# EAGLE schematic pcb6 (EAGLE 6.4)
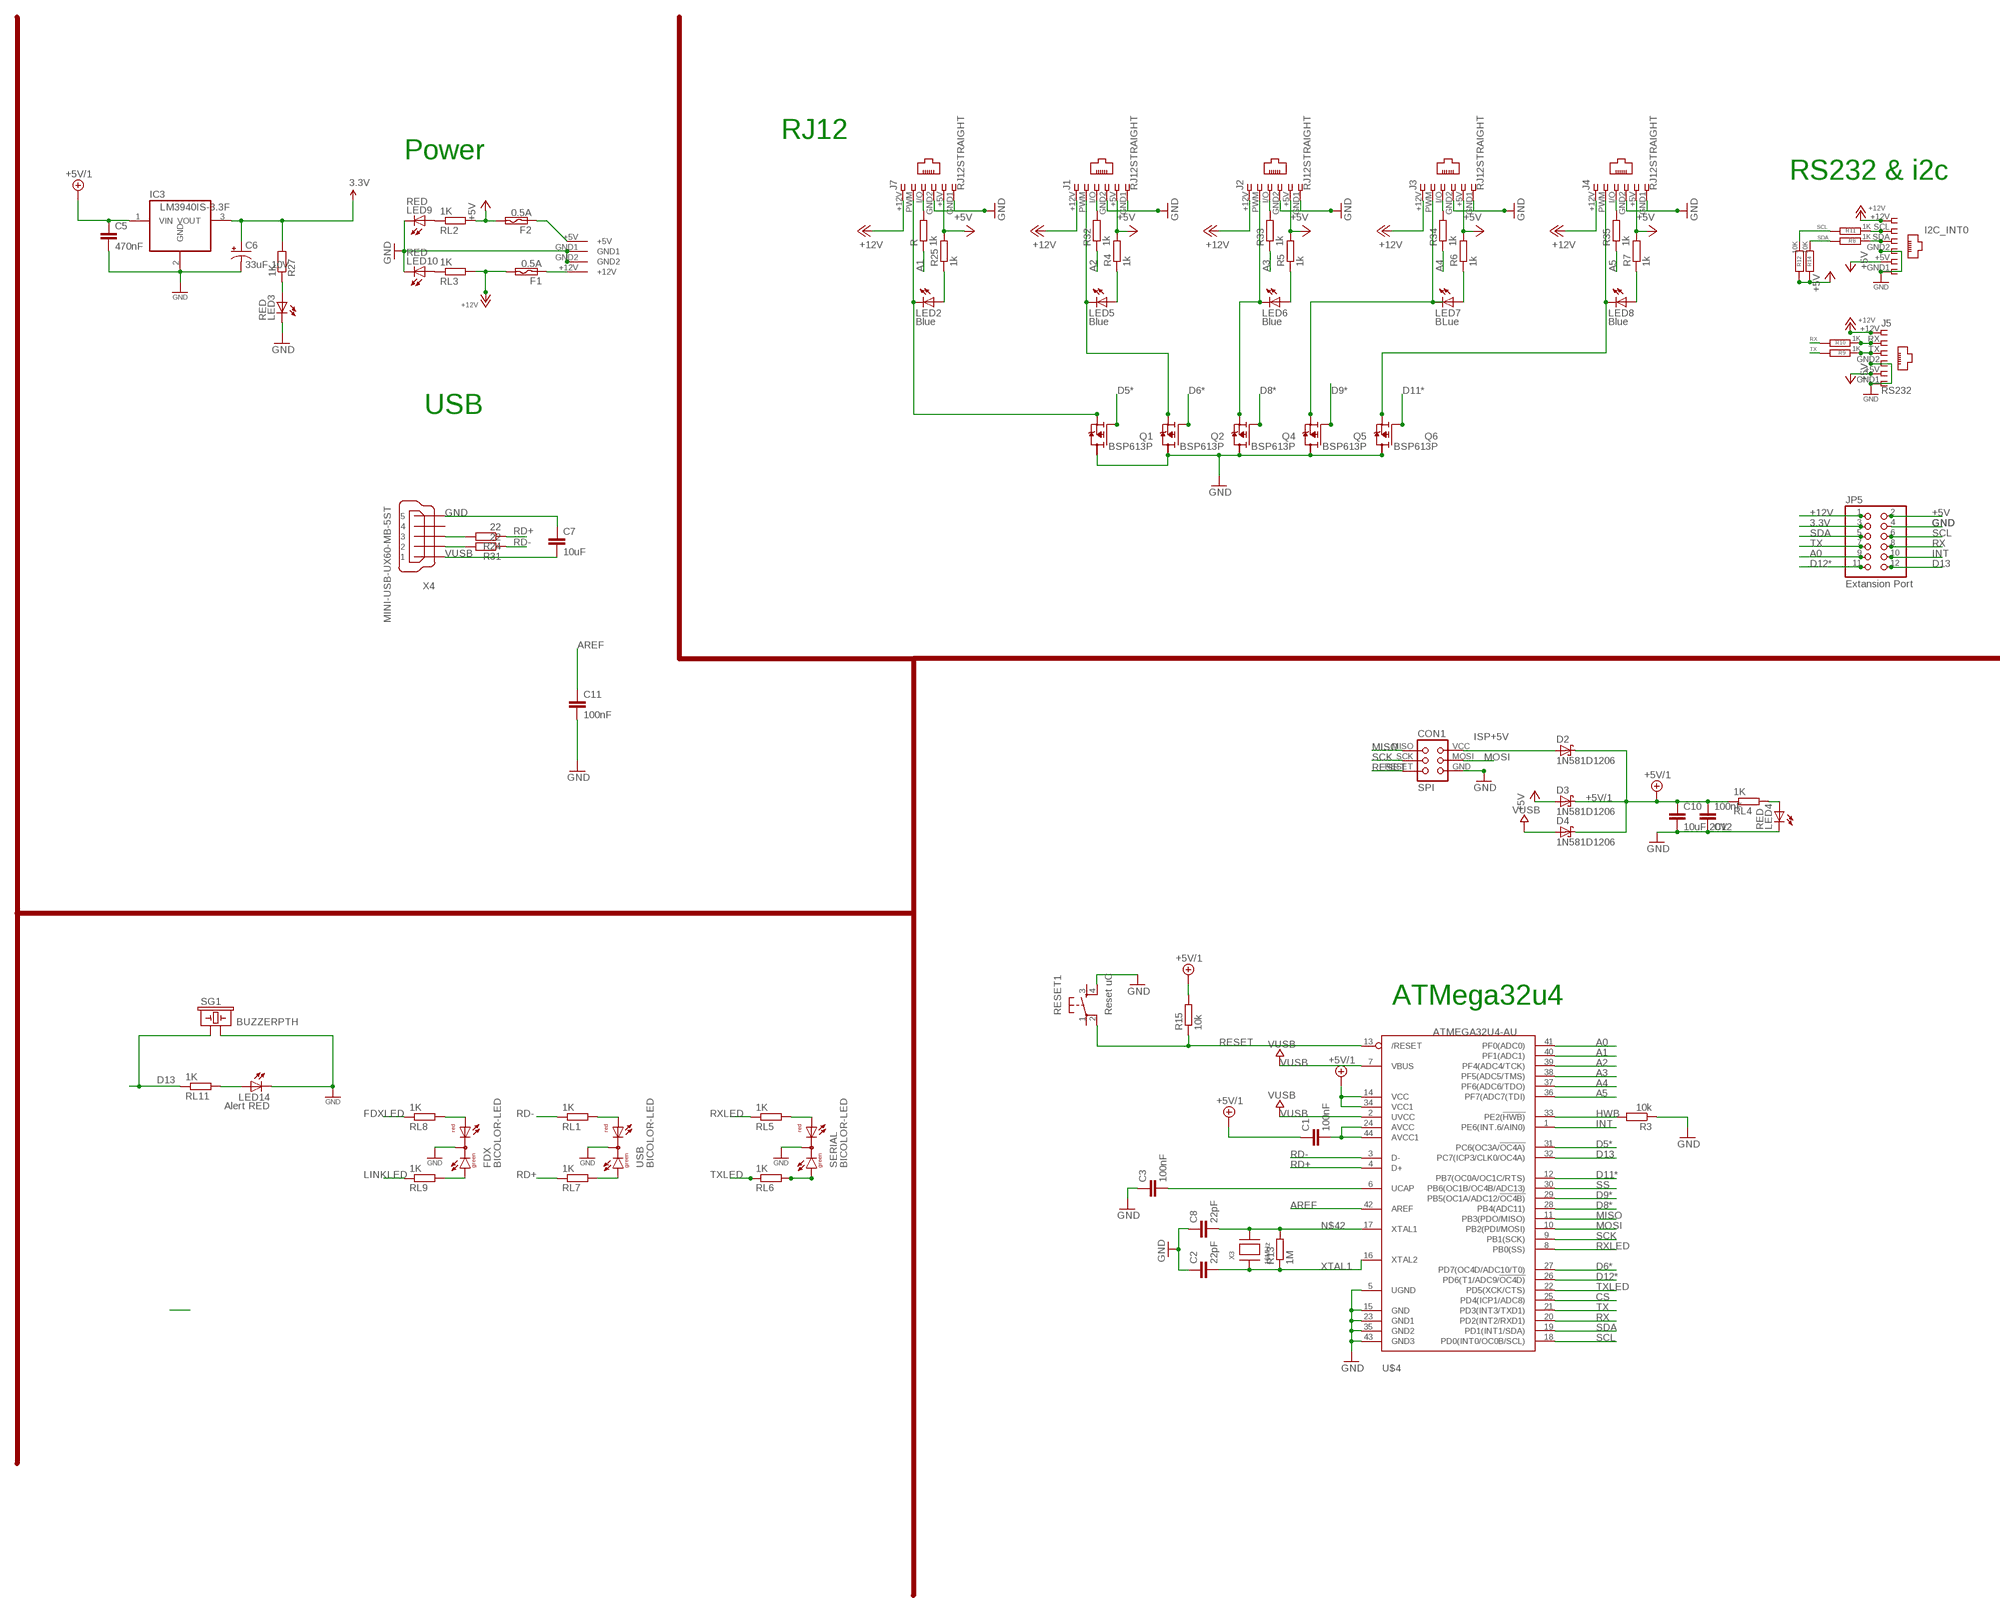
[diagram p0: schematic, sheet 1, part 1 of 2]
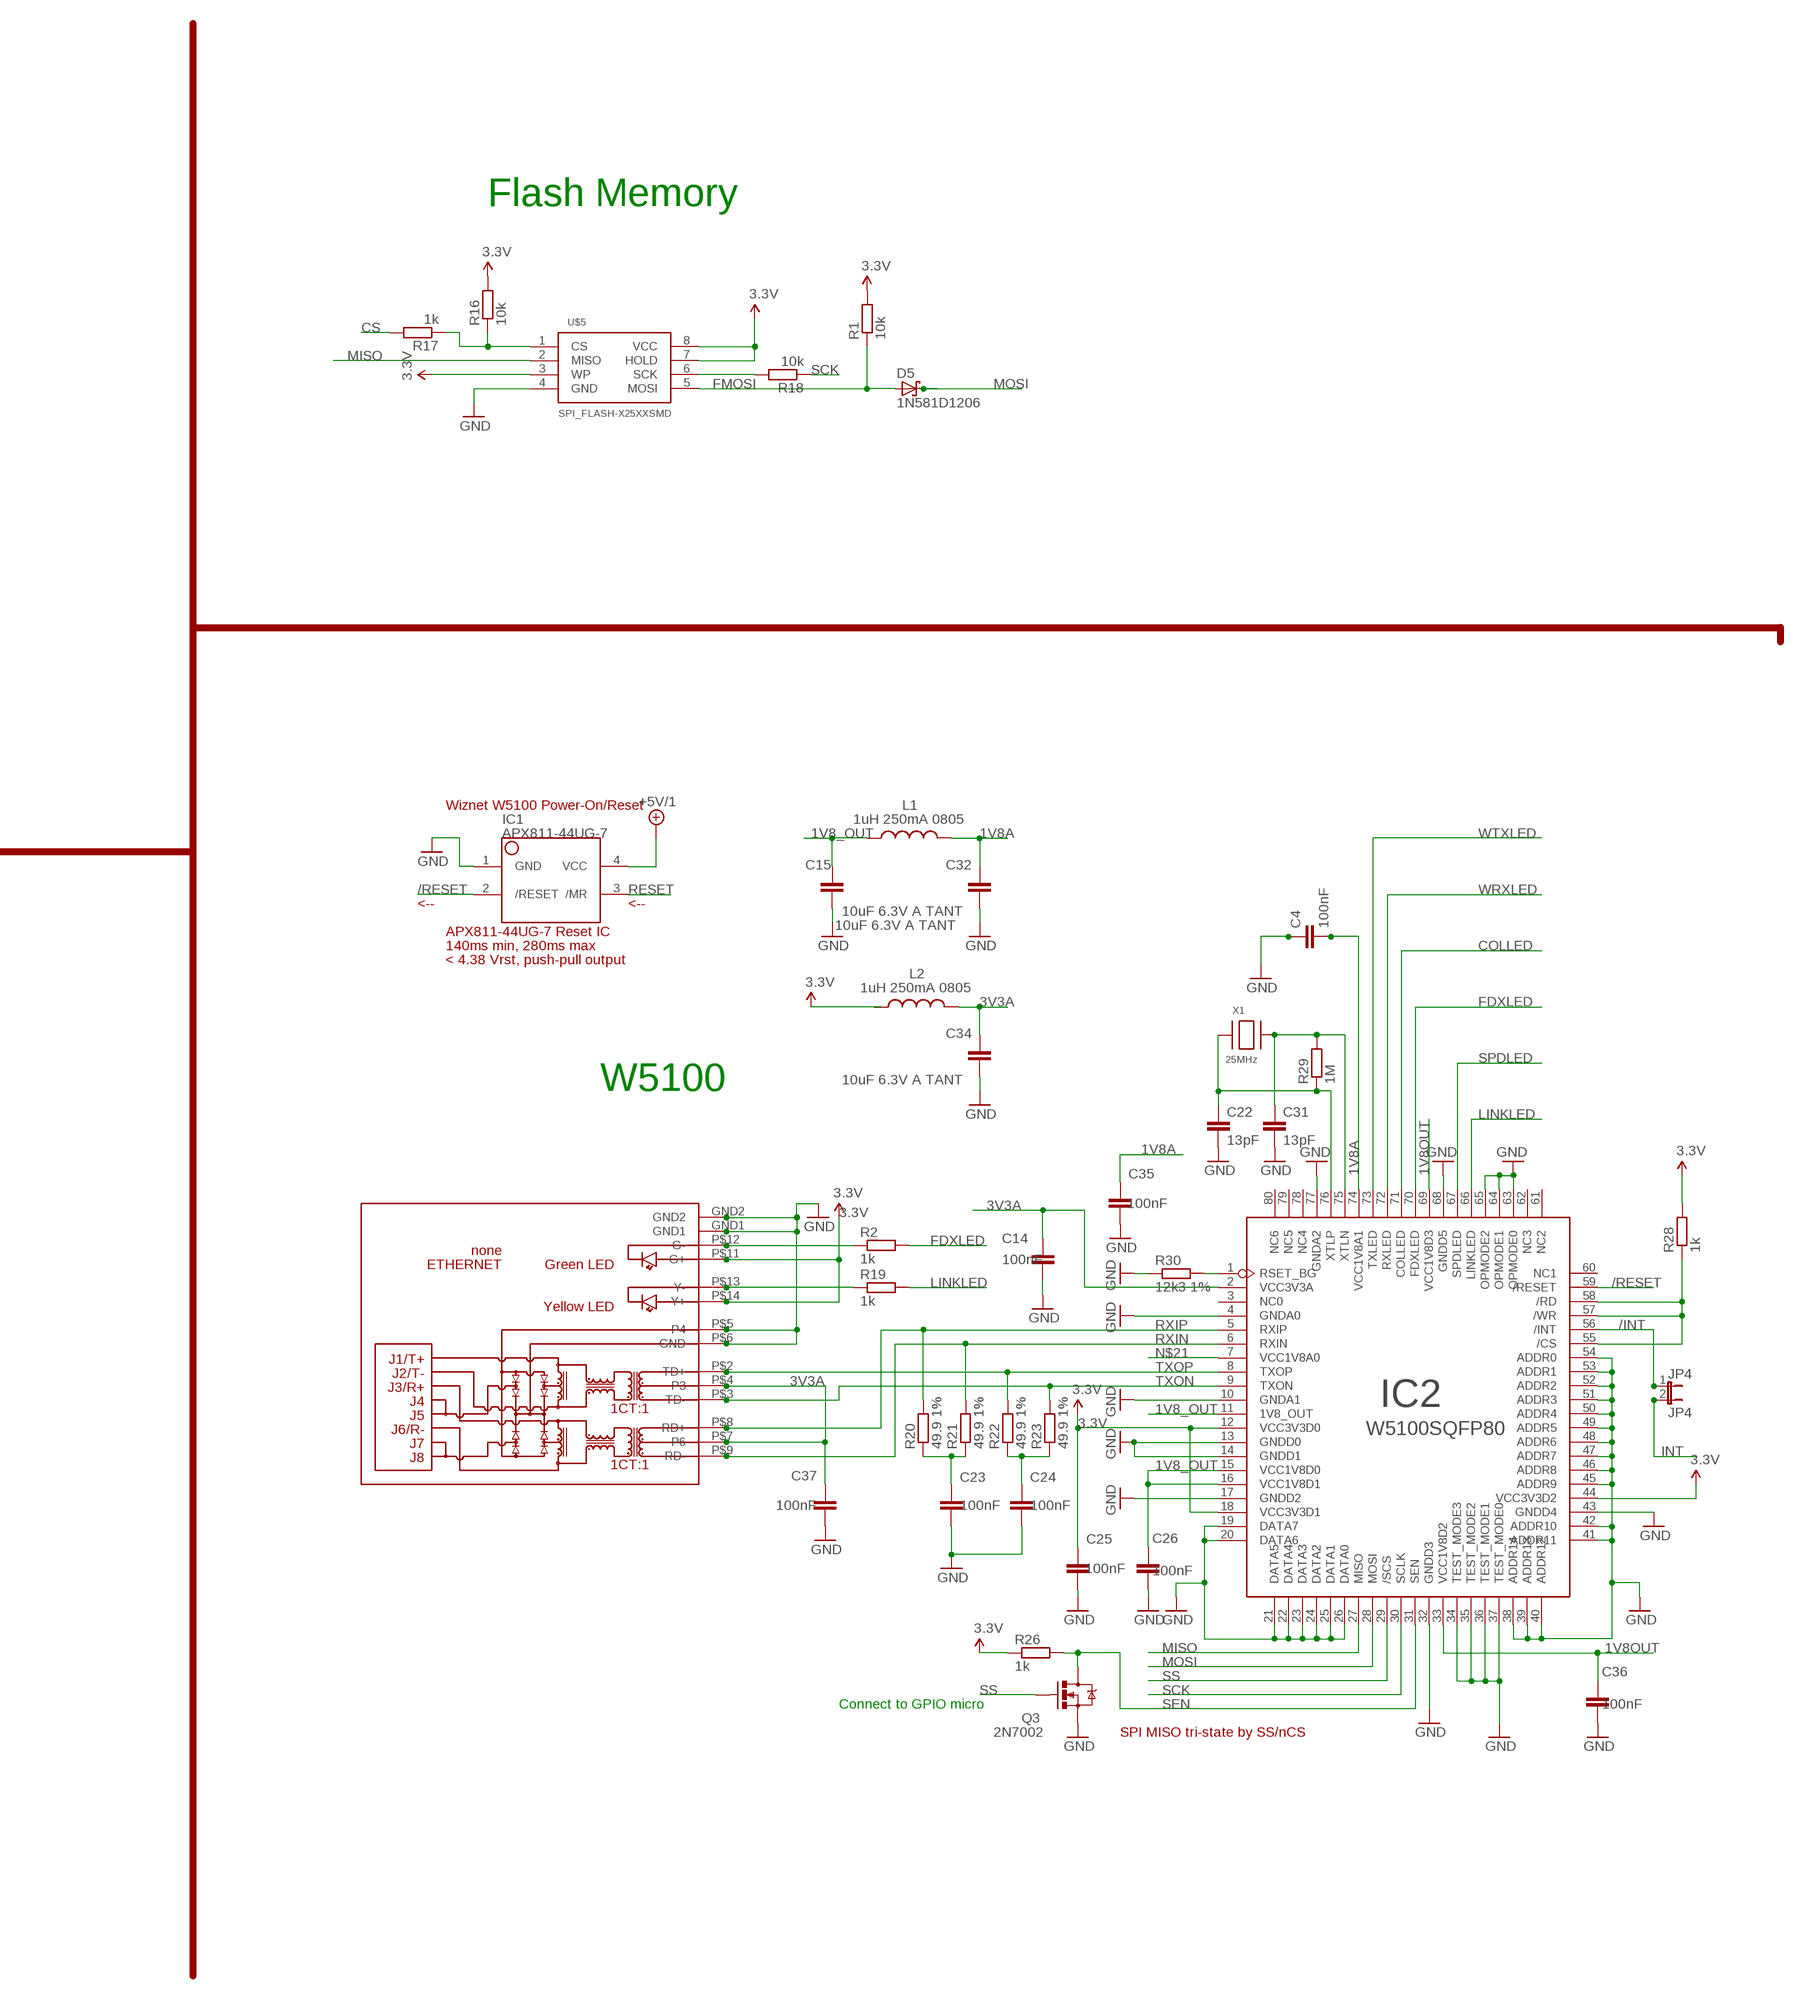
[diagram p1: schematic, sheet 1, part 2 of 2]

## Parts
C1  100nF  C-EUC1206  [C1206]
C2  22pF  C-EUC1206  [C1206]
C3  100nF  C-EUC1206  [C1206]
C4  100nF  C-EUC1206  [C1206]
C5  470nF  C-EUC1206  [C1206]
C6  33uF 10V  CAP_POL7343  [EIA7343]
C7  10uF  C-EUC1206  [C1206]
C8  22pF  C-EUC1206  [C1206]
C10  10uF 20V  C-EUC1206  [C1206]
C11  100nF  C-EUC1206  [C1206]
C12  100nF  C-EUC1206  [C1206]
C14  100nF  C-EUC1206  [C1206]
C15  10uF 6.3V A TANT  C-EUC1206  [C1206]
C22  13pF  C-EUC1206  [C1206]
C23  100nF  C-EUC1206  [C1206]
C24  100nF  C-EUC1206  [C1206]
C25  100nF  C-EUC1206  [C1206]
C26  100nF  C-EUC1206  [C1206]
C31  13pF  C-EUC1206  [C1206]
C32  10uF 6.3V A TANT  C-EUC1206  [C1206]
C34  10uF 6.3V A TANT  C-EUC1206  [C1206]
C35  100nF  C-EUC1206  [C1206]
C36  100nF  C-EUC1206  [C1206]
C37  100nF  C-EUC1206  [C1206]
CON1  SPI  TINYISP  [TINYISP]
D2  1N581D1206  [LED-1206]
D3  1N581D1206  [LED-1206]
D4  1N581D1206  [LED-1206]
D5  1N581D1206  [LED-1206]
ETHERNET  none  HY911103AHY911103A  [HY931147C]
F1  0.5A  POLYSWITCHSMD1812  [C1812]
F2  0.5A  POLYSWITCHSMD1812  [C1812]
FDX  BICOLOR-LED  [BICOLOR-3MM]
I2C_INT0  I2C  RJ12STRAIGHT-I2C  [RJ12-STRAIGHT-I2C]
IC1  APX811-44UG-7  APX81X-RESET-IC  [SOT143-R]
IC2  W5100SQFP80  [SQFP80]
IC3  LM3940IS-3.3F  [DD-3]
J1  RJ12STRAIGHT  [RJ12-STRAIGHT]
J2  RJ12STRAIGHT  [RJ12-STRAIGHT]
J3  RJ12STRAIGHT  [RJ12-STRAIGHT]
J4  RJ12STRAIGHT  [RJ12-STRAIGHT]
J5  RS232  RJ12STRAIGHT-RS232-SERVER  [RJ12-STRAIGHT-RS232]
J7  RJ12STRAIGHT  [RJ12-STRAIGHT]
JP4  JP4  JUMPER-2PTH  [1X02]
JP5  Extansion Port  PINHD-2X6  [2X06]
L1  1uH 250mA 0805  L-USL2012C  [L2012C]
L2  1uH 250mA 0805  L-USL2012C  [L2012C]
LED2  Blue  LED3MM  [LED3MM]
LED3  RED  LED3MM  [LED3MM]
LED4  RED  LED3MM  [LED3MM]
LED5  Blue  LED3MM  [LED3MM]
LED6  Blue  LED3MM  [LED3MM]
LED7  BLue  LED3MM  [LED3MM]
LED8  Blue  LED3MM  [LED3MM]
LED9  RED  LED3MM  [LED3MM]
LED10  RED  LED3MM  [LED3MM]
LED14  Alert RED  LED3MM  [LED3MM]
Q1  BSP613P  [PG-SOT-223]
Q2  BSP613P  [PG-SOT-223]
Q3  2N7002  MOSFET-NCHANNELSMD  [SOT23-3]
Q4  BSP613P  [PG-SOT-223]
Q5  BSP613P  [PG-SOT-223]
Q6  BSP613P  [PG-SOT-223]
R  1k  R-EU_R0805  [R0805]
R1  10k  R-EU_R1206  [R1206]
R2  1k  R-EU_R0805  [R0805]
R3  10k  R-EU_R1206  [R1206]
R4  1k  R-EU_R0805  [R0805]
R5  1k  R-EU_R0805  [R0805]
R6  1k  R-EU_R0805  [R0805]
R7  1k  R-EU_R0805  [R0805]
R8  1K  R-EU_R0805  [R0805]
R9  1K  R-EU_R0805  [R0805]
R10  1K  R-EU_R0805  [R0805]
R11  1K  R-EU_R0805  [R0805]
R12  10K  R-EU_R1206  [R1206]
R13  1M  R-EU_R1206  [R1206]
R14  10K  R-EU_R1206  [R1206]
R15  10k  R-EU_R1206  [R1206]
R16  10k  R-EU_R1206  [R1206]
R17  1k  R-EU_R0805  [R0805]
R18  10k  R-EU_R1206  [R1206]
R19  1k  R-EU_R0805  [R0805]
R20  49.9 1%  R-EU_R0805W  [R0805W]
R21  49.9 1%  R-EU_R0805W  [R0805W]
R22  49.9 1%  R-EU_R0805W  [R0805W]
R23  49.9 1%  R-EU_R0805W  [R0805W]
R24  22  R-EU_M1206  [M1206]
R25  1k  R-EU_R0805  [R0805]
R26  1k  R-EU_R0805  [R0805]
R27  1K  R-EU_R0805  [R0805]
R28  1k  R-EU_R0805  [R0805]
R29  1M  R-EU_R1206  [R1206]
R30  12k3 1%  R-EU_R0805W  [R0805W]
R31  22  R-EU_M1206  [M1206]
R32  1k  R-EU_R0805  [R0805]
R33  1k  R-EU_R0805  [R0805]
R34  1k  R-EU_R0805  [R0805]
R35  1k  R-EU_R0805  [R0805]
RESET1  Reset uC  TAC_SWITCHSMD  [TACTILE_SWITCH_SMD]
RL1  1K  R-EU_R0805  [R0805]
RL2  1K  R-EU_R0805  [R0805]
RL3  1K  R-EU_R0805  [R0805]
RL4  1K  R-EU_R0805  [R0805@1]
RL5  1K  R-EU_R0805  [R0805]
RL6  1K  R-EU_R0805  [R0805]
RL7  1K  R-EU_R0805  [R0805]
RL8  1K  R-EU_R0805  [R0805]
RL9  1K  R-EU_R0805  [R0805]
RL11  1K  R-EU_R0805  [R0805]
SERIAL  BICOLOR-LED  [BICOLOR-3MM]
SG1  BUZZERPTH  [BUZZER-12MM]
U$4  ATMEGA32U4-AU  [TQFP44]
U$5  SPI_FLASH-X25XXSMD  [SO08]
U$6  KPJX-4S-S  [KPJX-4S-S]
USB  BICOLOR-LED  [BICOLOR-3MM]
X1  25MHz  XTALNX6035  [NX6035]
X3  16MHz  XTALNX6035  [NX6035]
X4  MINI-USB-UX60-MB-5ST  [UX60-MB-5ST]

## Nets
1V8_OUT: C15.1 C26.1 IC2.11(1V8_OUT) IC2.15(VCC1V8D0) IC2.16(VCC1V8D1) L1.1
1V8A: C4.2 C32.1 C35.1 IC2.74(VCC1V8A1) L1.2
1V8OUT: C36.1 IC2.33(VCC1V8D2) IC2.69(VCC1V8D3)
3.3V: C6.A(+) C25.1 ETHERNET.P$11(G+) ETHERNET.P$14(Y+) IC2.12(VCC3V3D0) IC2.18(VCC3V3D1) IC2.44(VCC3V3D2) IC3.3(VOUT) JP5.3 R1.2 R16.2 R26.1 R27.2 R28.2 U$5.3(WP) U$5.7(HOLD) U$5.8(VCC)
3V3A: C14.1 C34.1 C37.1 ETHERNET.P$4(P3) ETHERNET.P$7(P6) IC2.2(VCC3V3A) L2.2
+5V [fine]: D3.A F2.2 I2C_INT0.+5V J1.+5V J2.+5V J3.+5V J4.+5V J5.+5V J7.+5V JP5.2 R4.2 R5.2 R6.2 R7.2 R12.2 R14.2 R25.2 RL2.2
+5V/1 [fine]: C1.1 C5.1 C10.1 C12.2 D2.C D3.C D4.C IC1.4(VCC) IC3.1(VIN) R15.2 RL4.1 U$4.14(VCC) U$4.34(VCC1)
+12V: F1.2 I2C_INT0.+12V J1.+12V J2.+12V J3.+12V J4.+12V J5.+12V J7.+12V JP5.1 RL3.2
/INT: IC2.56(/INT) JP4.1
/RESET: IC1.2(/RESET) IC2.59(/RESET)
A0: JP5.9 U$4.41(PF0(ADC0))
A1: R.1 U$4.40(PF1(ADC1))
A2: R32.1 U$4.39(PF4(ADC4/TCK))
A3: R33.1 U$4.38(PF5(ADC5/TMS))
A4: R34.1 U$4.37(PF6(ADC6/TDO))
A5: R35.1 U$4.36(PF7(ADC7(TDI))
AREF: C11.1 U$4.42(AREF)
COLLED: IC2.71(COLLED)
CS: R17.2 U$4.25(PD4(ICP1/ADC8))
D2B4: I2C_INT0.SDA R8.1
D2B5: J5.TX R9.1
D5*: Q1.1(G) U$4.31(PC6(OC3A/!OC4A))
D6*: Q2.1(G) U$4.27(PD7(OC4D/ADC10/T0))
D8*: Q4.1(G) U$4.28(PB4(ADC11))
D9*: Q5.1(G) U$4.29(PB5(OC1A/ADC12/!OC4B))
D11*: Q6.1(G) U$4.12(PB7(OC0A/OC1C/RTS))
D12*: JP5.11 U$4.26(PD6(T1/ADC9/!OC4D))
D13: JP5.12 RL11.1 SG1.+ U$4.32(PC7(ICP3/CLK0/OC4A))
D+USB: R24.2 X4.3
D-USB: R31.2 X4.2
FDXLED: IC2.70(FDXLED) R2.2 RL8.1
FMOSI: D5.A R1.1 U$5.5(MOSI)
GND [VIN]: C2.1 C3.1 C4.1 C5.2 C6.C(-) C7.1 C8.1 C10.2 C11.2 C12.1 C14.2 C15.2 C22.2 C23.2 C24.2 C25.2 C26.2 C31.2 C32.2 C34.2 C35.2 C36.2 C37.2 CON1.GND ETHERNET.GND1 ETHERNET.GND2 ETHERNET.P$5(P4) ETHERNET.P$6(GND) FDX.2(C) I2C_INT0.GND1 I2C_INT0.GND2 IC1.1(GND) IC2.4(GNDA0) IC2.10(GNDA1) IC2.13(GNDD0) IC2.14(GNDD1) IC2.17(GNDD2) IC2.19(DATA7) IC2.20(DATA6) IC2.21(DATA5) IC2.22(DATA4) IC2.23(DATA3) IC2.24(DATA2) IC2.25(DATA1) IC2.26(DATA0) IC2.32(GNDD3) IC2.34(TEST_MODE3) IC2.35(TEST_MODE2) IC2.36(TEST_MODE1) IC2.37(TEST_MODE0) IC2.38(ADDR14) IC2.39(ADDR13) IC2.40(ADDR12) IC2.41(ADDR11) IC2.42(ADDR10) IC2.43(GNDD4) IC2.45(ADDR9) IC2.46(ADDR8) IC2.47(ADDR7) IC2.48(ADDR6) IC2.49(ADDR5) IC2.50(ADDR4) IC2.51(ADDR3) IC2.52(ADDR2) IC2.53(ADDR1) IC2.54(ADDR0) IC2.63(OPMODE0) IC2.64(OPMODE1) IC2.65(OPMODE2) IC2.68(GNDD5) IC2.77(GNDA2) IC3.2(GND) J1.GND1 J1.GND2 J2.GND1 J2.GND2 J3.GND1 J3.GND2 J4.GND1 J4.GND2 J5.GND1 J5.GND2 J7.GND1 J7.GND2 JP5.4 LED3.K(C) LED4.K(C) LED9.K(C) LED10.K(C) LED14.K(C) Q1.2(D) Q2.2(D) Q3.2(S) Q4.2(D) Q5.2(D) Q6.2(D) R3.1 R30.1 RESET1.4 SERIAL.2(C) SG1.- U$4.5(UGND) U$4.15(GND) U$4.23(GND1) U$4.35(GND2) U$4.43(GND3) U$5.4(GND) U$6.GND1 U$6.GND2 USB.2(C) X4.5
HWB: R3.2 U$4.33(PE2(!HWB))
INT: JP4.2 JP5.10 U$4.1(PE6(INT.6/AIN0))
ISP+5V: CON1.VCC D2.A
LINKLED: IC2.66(LINKLED) R19.2 RL9.1
MISO: CON1.MISO IC2.27(MISO) U$4.11(PB3(PDO/MISO)) U$5.2(MISO)
MOSI: CON1.MOSI D5.C IC2.28(MOSI) U$4.10(PB2(PDI/MOSI))
N$1: J2.PWM LED6.K(C) Q4.3(S)
N$2: J1.I/O R32.2
N$3 [fine]: C1.2 U$4.24(AVCC) U$4.44(AVCC1)
N$4: LED5.A R4.1
N$5: J3.PWM LED7.K(C) Q5.3(S)
N$6: FDX.3(AR) RL8.2
N$7: J2.I/O R33.2
N$8: RL1.2 USB.3(AR)
N$9: C24.1 R22.1 R23.1
N$10: R16.1 R17.1 U$5.1(CS)
N$11: FDX.1(AG) RL9.2
N$12: LED4.A RL4.2
N$13: RL5.2 SERIAL.3(AR)
N$14: RL7.2 USB.1(AG)
N$15: RL6.2 SERIAL.1(AG)
N$16: C3.2 U$4.6(UCAP)
N$17: LED2.A R25.1
N$18: J7.I/O R.2
N$19: J4.PWM LED8.K(C) Q6.3(S)
N$20: LED3.A R27.1
N$21: IC2.7(VCC1V8A0)
N$22: LED6.A R5.1
N$23: R18.2 U$5.6(SCK)
N$24: IC2.55(/CS) IC2.57(/WR) IC2.58(/RD) R28.1
N$25: LED14.A RL11.2
N$28: J1.PWM LED5.K(C) Q2.3(S)
N$29: J3.I/O R34.2
N$30: LED7.A R6.1
N$32: J4.I/O R35.2
N$33: LED8.A R7.1
N$34: J7.PWM LED2.K(C) Q1.3(S)
N$38: F2.1 U$6.+5V
N$39: F1.1 U$6.+12V
N$42: C8.2 R13.2 U$4.17(XTAL1) X3.P$2
N$67: ETHERNET.P$12(G-) R2.1
N$70: J5.RX R10.1
N$71: I2C_INT0.SCL R11.1
N$75: LED10.A RL3.1
N$76: LED9.A RL2.1
N$321: C23.1 R20.1 R21.1
N$322: IC2.1(RSET_BG) R30.2
N$332: ETHERNET.P$13(Y-) R19.1
RD+: R24.1 RL7.1 U$4.4(D+)
RD-: R31.1 RL1.1 U$4.3(D-)
RESET: CON1.RESET IC1.3(/MR) R15.1 RESET1.2 U$4.13(/RESET)
RX: JP5.8 R10.2 U$4.20(PD2(INT2/RXD1))
RXIN: ETHERNET.P$9(RD-) IC2.6(RXIN) R21.2
RXIP: ETHERNET.P$8(RD+) IC2.5(RXIP) R20.2
RXLED: RL5.1 U$4.8(PB0(SS))
SCK: CON1.SCK IC2.30(SCLK) R18.1 U$4.9(PB1(SCK))
SCL: JP5.6 R11.2 R12.1 U$4.18(PD0(INT0/OC0B/SCL))
SDA: JP5.5 R8.2 R14.1 U$4.19(PD1(INT1/SDA))
SEN: IC2.31(SEN) Q3.3(D) R26.2
SPDLED: IC2.67(SPDLED)
SS: IC2.29(/SCS) Q3.1(G) U$4.30(PB6(OC1B/OC4B/ADC13))
TX: JP5.7 R9.2 U$4.21(PD3(INT3/TXD1))
TXLED: RL6.1 U$4.22(PD5(XCK/CTS))
TXON: ETHERNET.P$3(TD-) IC2.9(TXON) R23.2
TXOP: ETHERNET.P$2(TD+) IC2.8(TXOP) R22.2
VUSB: C7.2 D4.A U$4.2(UVCC) U$4.7(VBUS) X4.1
WRXLED: IC2.72(RXLED)
WTXLED: IC2.73(TXLED)
XTAL1: C2.2 R13.1 U$4.16(XTAL2) X3.P$1
XTLN: C31.1 IC2.75(XTLN) R29.2 X1.P$2
XTLP: C22.1 IC2.76(XTLP) R29.1 X1.P$1
Unconnected: IC2.3(NC0) IC2.60(NC1) IC2.61(NC2) IC2.62(NC3) IC2.78(NC4) IC2.79(NC5) IC2.80(NC6) L2.1 Q1.4(D) Q2.4(D) Q4.4(D) Q5.4(D) Q6.4(D) RESET1.1 RESET1.3 X4.4

## Notes on the sheet
- RJ12
- Power
- RS232 & i2c
- Flash Memory
- USB
- Wiznet W5100 Power-On/Reset
- <-- | <--
- APX811-44UG-7 Reset IC
- 140ms min, 280ms max
- < 4.38 Vrst, push-pull output
- W5100
- ATMega32u4
- Connect to GPIO micro
- SPI MISO tri-state by SS/nCS

## Library data of the parts
C1-C5 C7 C8 C10-C12 C14 C15 C22-C26 C31 C32 C34-C37 = rcl:C-EU: CAPACITOR, European symbol
C6 = SparkFun:CAP_POL: Capacitor Polarized These are standard SMD and PTH capacitors. Normally 10uF, 47uF, and 100uF in electrolytic and tantalum varieties. Always verify the external diameter of the through hole cap, it varies with capacity, voltage, and manufacturer. The EIA devices should be standard.
CON1 = lpatiny:TINYISP: CONNECTOR; OC_FARNELL: unknown; OC_NEWARK: unknown
D2-D5 = lpatiny:1N581*: 1.0A SCHOTTKY BARRIER RECTIFIER Source: http://www.diodes.com/datasheets/ds23001.pdf
ETHERNET = bioreactor:HY911103A
F1 F2 = lpatiny:POLYSWITCH: PolySwitch (TM) Resettable Device Source: Data sheet <http://www.farnell.com/datasheets/13482.pdf>
FDX SERIAL USB = lpatiny:BICOLOR-LED: T-1(3mm) BI-COLOR INDICATOR LAMP Source: Kingbright .. 2_colour_led_.pdf
I2C_INT0 J1-J5 J7 = lpatiny:RJ12: CORCOM Modular RJ Jacks No Shield Source: www.tycoelectronics.com .. ENG_DS_1654001_1099_RJ_L_0507.pdf
IC1 = freetronics-master-v1:APX81X-RESET-IC
IC2 = freetronics-marc:W5100: WIZnet W5100
IC3 = lpatiny:LM3940IS-3.3: 1A Low Dropout (LDO) for 5V to 3.3V conversion; MF: TEXAS INSTRUMENTS; MPN: REG1117FAKTTT; OC_FARNELL: 1296120; OC_NEWARK: 87H2562
JP4 = SparkFun:JUMPER-2: Jumper Basic 0.1" spaced jumper. Use with breakaway headers.
JP5 = pinhead:PINHD-2X6: PIN HEADER
L1 L2 = rcl:L-US: INDUCTOR, American symbol
LED2-LED10 LED14 = lpatiny:LED3MM
Q1 Q2 Q4-Q6 = infineon:BSP613P: SIPMOS (R) Small-Signal-Transistor P-Channel (2 Drain) Source: http://www.infineon.com/dgdl/BSP613P_Rev2.4.pdf; OC_FARNELL: unknown; OC_NEWARK: unknown
Q3 = freetronics:MOSFET-NCHANNEL
R R1-R23 R25-R30 R32-R35 RL1-RL3 RL5-RL9 RL11 = rcl:R-EU_: RESISTOR, European symbol
R24 R31 RL4 = resistor:R-EU_: RESISTOR, European symbol
RESET1 = SparkFun:TAC_SWITCH: Momentary Switch Button commonly used for reset or general input. Spark Fun Electronics SKU : COM-00097
SG1 = SparkFun:BUZZER: Buzzer 12mm Spark Fun Electronics SKU : Comp-Buzzer
U$4 = adafruit:ATMEGA32U4: http://www.ladyada.net/library/eagle
U$5 = SparkFun:SPI_FLASH-X25XX: 8pin SPI Flash series x25xx. Works with devices like W25X32 and BR25L32
U$6 = lpatiny:KPJX-4S-S
X1 X3 = lpatiny:XTAL: Low cost SMT crystals, no capacitors included http://www.ladyada.net/library/eagle
X4 = con-hirose:MINI-USB-: MINI USB Connector Source: http://www.hirose.co.jp/cataloge_hp/e24000019.pdf; OC_FARNELL: unknown; OC_NEWARK: unknown

## Net classes
0 default: width 0.203 mm
1 power: width 0.305 mm
2 VIN: width 0.305 mm, drill 0.076 mm, clearance 0.025 mm
3 fine: width 0.305 mm
4 aref: width 0.254 mm, drill 0.076 mm, clearance 0.076 mm